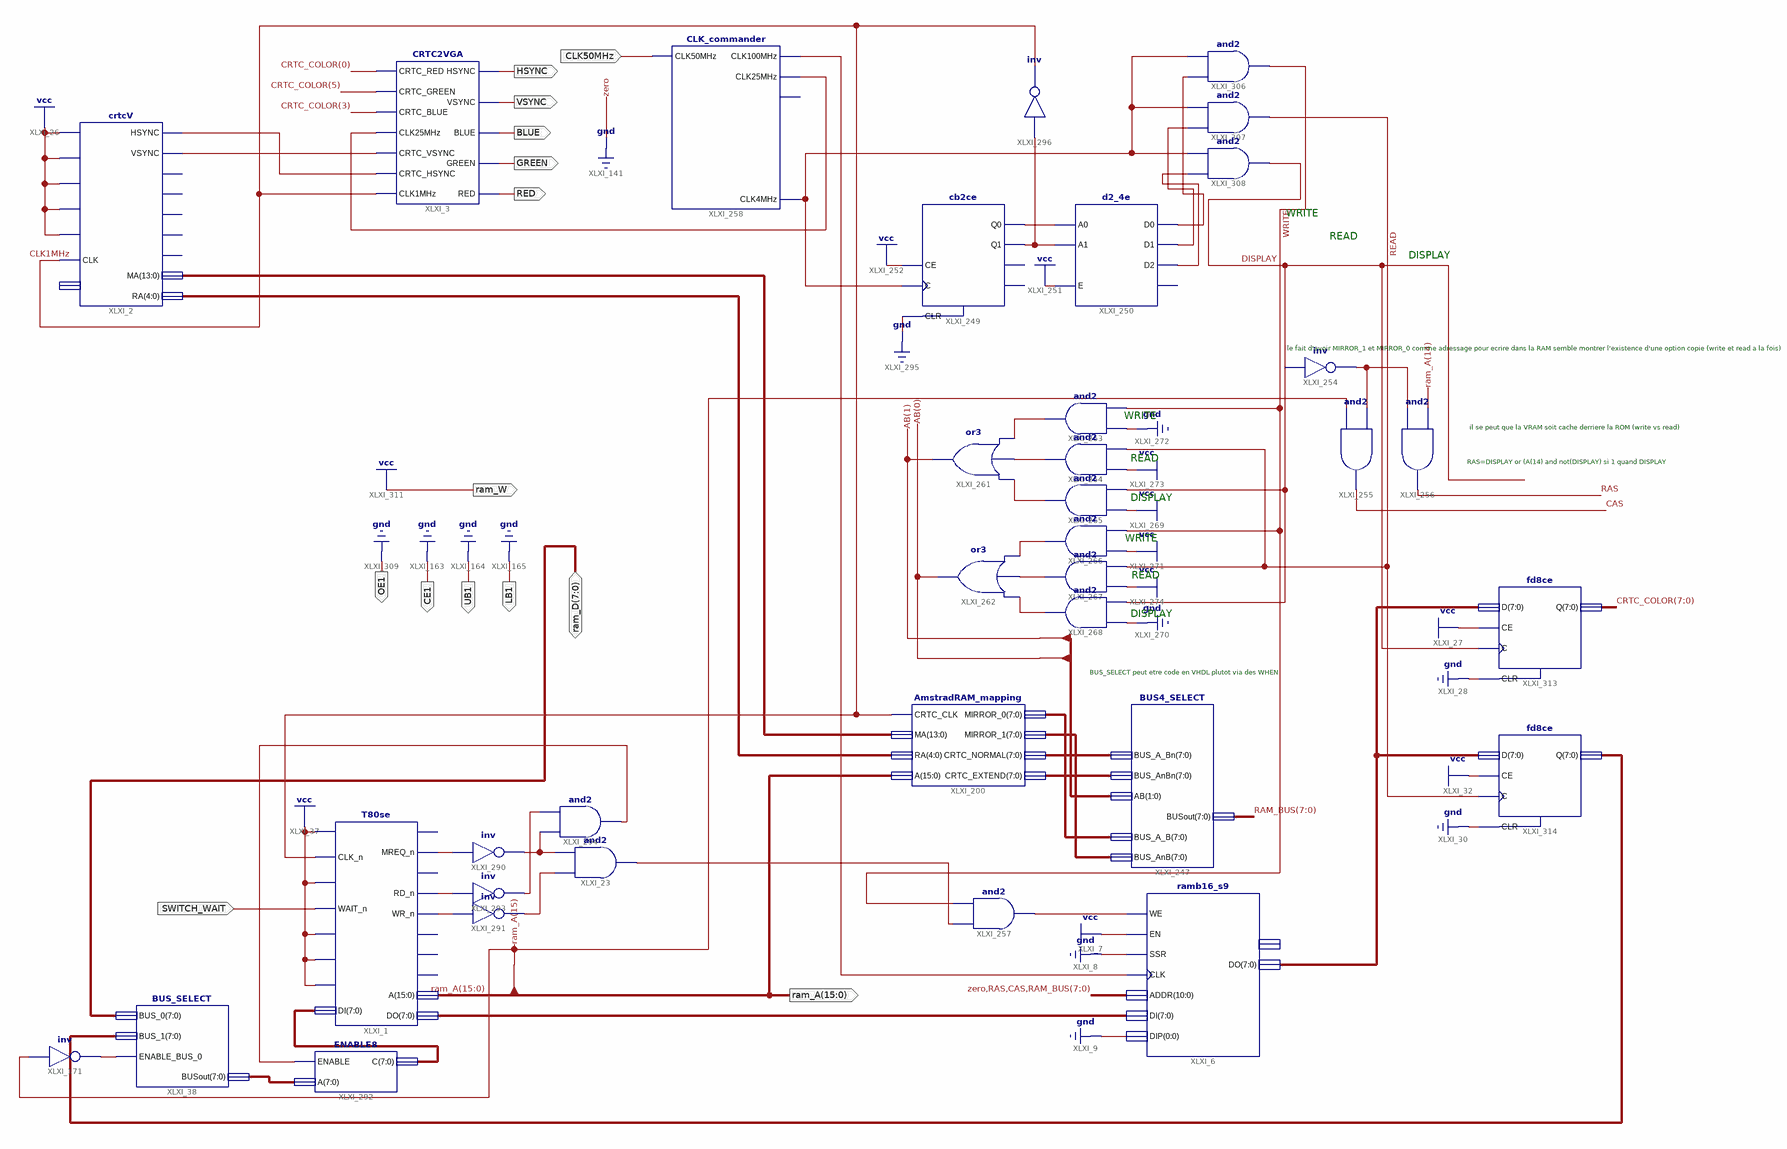
[diagram p0: schematic sheet 1]
// Xilinx ISE schematic amstrad_ROM_test.sch (spartan3) as structural Verilog: 35 symbols, 14 ports
module amstrad_ROM_test (
  input  CLK50MHz,
  input  SWITCH_WAIT,
  inout  [7:0] ram_D,
  output [15:0] ram_A,
  output LB1,
  output CE1,
  output UB1,
  output HSYNC,
  output VSYNC,
  output BLUE,
  output GREEN,
  output RED,
  output OE1,
  output ram_W
);

  wire CAS, CLK1MHz, DISPLAY, RAS, READ, WRITE, XLXN_20, XLXN_21, XLXN_118, XLXN_262, XLXN_274, XLXN_287,
       XLXN_288, XLXN_297, XLXN_304, XLXN_305, XLXN_306, XLXN_307, XLXN_308, XLXN_309, XLXN_356, XLXN_357,
       XLXN_358, XLXN_359, XLXN_369, XLXN_371, XLXN_373, XLXN_377, XLXN_380, XLXN_392, XLXN_393, XLXN_394,
       XLXN_397;
  wire [1:0] AB;
  wire [4:0] XLXN_247;
  wire [7:0] CRTC_COLOR, RAM_BUS, XLXN_93, XLXN_244, XLXN_260, XLXN_261, XLXN_302, XLXN_303, XLXN_366,
       XLXN_367, XLXN_368;
  wire [13:0] XLXN_246;

  AmstradRAM_mapping XLXI_200 (
    .CRTC_CLK(CLK1MHz), .MA(XLXN_246), .RA(XLXN_247), .A(ram_A), .MIRROR_0(XLXN_303), .MIRROR_1(XLXN_302),
    .CRTC_NORMAL(XLXN_260), .CRTC_EXTEND(XLXN_261));
  crtcV XLXI_2 (
    .IOCLK(1'b1), .RS(1'b1), .CS(1'b1), .RW(1'b1), .RESET(1'b1), .CLK(CLK1MHz), .HSYNC(XLXN_20),
    .VSYNC(XLXN_21), .MA(XLXN_246), .RA(XLXN_247));  // open: Din, DISP, CPCHSYNC, CPCVSYNC, CPCDISP, CPCBLACK
  T80se XLXI_1 (
    .RESET_n(1'b1), .CLK_n(CLK1MHz), .CLKEN(1'b1), .WAIT_n(SWITCH_WAIT), .INT_n(1'b1), .NMI_n(1'b1),
    .BUSRQ_n(1'b1), .DI(XLXN_368), .MREQ_n(XLXN_356), .RD_n(XLXN_369), .WR_n(XLXN_359), .A(ram_A),
    .DO(XLXN_93));  // open: M1_n, IORQ_n, RFSH_n, HALT_n, BUSAK_n
  BUS_SELECT XLXI_38 (.BUS_0(ram_D), .BUS_1(XLXN_366), .ENABLE_BUS_0(XLXN_118), .BUSout(XLXN_367));
  not XLXI_171 (XLXN_118, ram_A[15]);
  and XLXI_23 (XLXN_287, XLXN_358, XLXN_357);
  ramb16_s9 XLXI_6 (
    .ADDR({1'b0, RAS, CAS, RAM_BUS}), .CLK(XLXN_377), .DI(XLXN_93), .DIP(1'b0), .EN(1'b1), .SSR(1'b0),
    .WE(XLXN_288), .DO(XLXN_244));  // open: DOP
  BUS4_SELECT XLXI_247 (
    .BUS_A_Bn(XLXN_260), .BUS_AnBn(XLXN_261), .AB(AB), .BUSout(RAM_BUS), .BUS_A_B(XLXN_303),
    .BUS_AnB(XLXN_302));
  not XLXI_254 (XLXN_274, DISPLAY);
  and XLXI_255 (CAS, ram_A[15], XLXN_274);
  and XLXI_256 (RAS, XLXN_274, ram_A[14]);
  and XLXI_257 (XLXN_288, XLXN_287, WRITE);
  CLK_commander XLXI_258 (
    .CLK50MHz(CLK50MHz), .CLK100MHz(XLXN_377), .CLK25MHz(XLXN_297), .CLK4MHz(XLXN_397));  // open: CLK1MHz
  or XLXI_261 (AB[1], XLXN_304, XLXN_305, XLXN_306);
  or XLXI_262 (AB[0], XLXN_307, XLXN_308, XLXN_309);
  and XLXI_263 (XLXN_304, WRITE, 1'b0);
  and XLXI_264 (XLXN_305, READ, 1'b1);
  and XLXI_265 (XLXN_306, DISPLAY, 1'b1);
  and XLXI_266 (XLXN_307, WRITE, 1'b1);
  and XLXI_267 (XLXN_308, READ, 1'b1);
  and XLXI_268 (XLXN_309, DISPLAY, 1'b0);
  CRTC2VGA XLXI_3 (
    .CRTC_RED(CRTC_COLOR[0]), .CRTC_GREEN(CRTC_COLOR[5]), .CRTC_BLUE(CRTC_COLOR[3]), .CLK25MHz(XLXN_297),
    .CRTC_VSYNC(XLXN_21), .CRTC_HSYNC(XLXN_20), .CLK1MHz(CLK1MHz), .HSYNC(HSYNC), .VSYNC(VSYNC), .BLUE(BLUE),
    .GREEN(GREEN), .RED(RED));
  not XLXI_290 (XLXN_357, XLXN_356);
  not XLXI_291 (XLXN_358, XLXN_359);
  ENABLE8 XLXI_292 (.ENABLE(XLXN_373), .A(XLXN_367), .C(XLXN_368));
  not XLXI_293 (XLXN_371, XLXN_369);
  and XLXI_294 (XLXN_373, XLXN_357, XLXN_371);
  not XLXI_296 (CLK1MHz, XLXN_380);
  cb2ce XLXI_249 (.C(XLXN_397), .CE(1'b1), .CLR(1'b0), .Q0(XLXN_262), .Q1(XLXN_380));  // open: CEO, TC
  d2_4e XLXI_250 (.A0(XLXN_262), .A1(XLXN_380), .E(1'b1), .D0(XLXN_394), .D1(XLXN_393), .D2(XLXN_392));  // open: D3
  and XLXI_306 (WRITE, XLXN_394, XLXN_397);
  and XLXI_307 (READ, XLXN_393, XLXN_397);
  and XLXI_308 (DISPLAY, XLXN_392, XLXN_397);
  fd8ce XLXI_313 (.C(DISPLAY), .CE(1'b1), .CLR(1'b0), .D(XLXN_244), .Q(CRTC_COLOR));
  fd8ce XLXI_314 (.C(READ), .CE(1'b1), .CLR(1'b0), .D(XLXN_244), .Q(XLXN_366));

  assign CE1 = 1'b0;
  assign LB1 = 1'b0;
  assign OE1 = 1'b0;
  assign ram_W = 1'b1;
  assign UB1 = 1'b0;

  // Notes on the sheet:
  //   WRITE
  //   READ
  //   DISPLAY
  //   le fait d'avoir MIRROR_1 et MIRROR_0 comme adressage pour ecrire dans la RAM semble montrer l'existence d'une option copie (write et read a la fois)
  //   WRITE
  //   il se peut que la VRAM soit cache derriere la ROM (write vs read)
  //   READ
  //   RAS=DISPLAY or (A(14) and not(DISPLAY) si 1 quand DISPLAY
  //   DISPLAY
  //   WRITE
  //   READ
  //   DISPLAY
  //   BUS_SELECT peut etre code en VHDL plutot via des WHEN
endmodule
